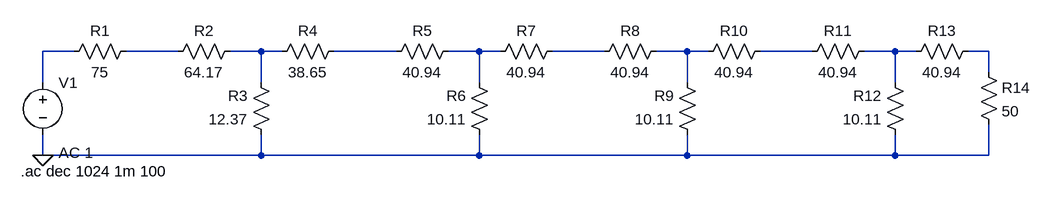
[diagram p0: schematic Draft4.asc]
Draft4.asc, the LTspice schematic file:
Version 4
SHEET 1 1476 680
WIRE 0 80 -48 80
WIRE 160 80 80 80
WIRE 288 80 240 80
WIRE 320 80 288 80
WIRE 496 80 400 80
WIRE 624 80 576 80
WIRE 656 80 624 80
WIRE 816 80 736 80
WIRE 944 80 896 80
WIRE 976 80 944 80
WIRE 1136 80 1056 80
WIRE 1264 80 1216 80
WIRE 1296 80 1264 80
WIRE 1408 80 1376 80
WIRE 1408 112 1408 80
WIRE -48 128 -48 80
WIRE 288 128 288 80
WIRE 624 128 624 80
WIRE 944 128 944 80
WIRE 1264 128 1264 80
WIRE -48 240 -48 208
WIRE 288 240 288 208
WIRE 288 240 -48 240
WIRE 624 240 624 208
WIRE 624 240 288 240
WIRE 944 240 944 208
WIRE 944 240 624 240
WIRE 1264 240 1264 208
WIRE 1264 240 944 240
WIRE 1408 240 1408 192
WIRE 1408 240 1264 240
FLAG -48 240 0
SYMBOL voltage -48 112 R0
WINDOW 123 24 124 Left 2
WINDOW 39 0 0 Left 0
SYMATTR InstName V1
SYMATTR Value ""
SYMATTR Value2 AC 1
SYMBOL res 96 64 R90
WINDOW 0 0 56 VBottom 2
WINDOW 3 32 56 VTop 2
SYMATTR InstName R1
SYMATTR Value 75
SYMBOL res 256 64 R90
WINDOW 0 0 56 VBottom 2
WINDOW 3 32 56 VTop 2
SYMATTR InstName R2
SYMATTR Value 64.17
SYMBOL res 304 224 R180
WINDOW 0 36 76 Left 2
WINDOW 3 36 40 Left 2
SYMATTR InstName R3
SYMATTR Value 12.37
SYMBOL res 304 96 R270
WINDOW 0 32 56 VTop 2
WINDOW 3 0 56 VBottom 2
SYMATTR InstName R4
SYMATTR Value 38.65
SYMBOL res 592 64 R90
WINDOW 0 0 56 VBottom 2
WINDOW 3 32 56 VTop 2
SYMATTR InstName R5
SYMATTR Value 40.94
SYMBOL res 640 224 R180
WINDOW 0 36 76 Left 2
WINDOW 3 36 40 Left 2
SYMATTR InstName R6
SYMATTR Value 10.11
SYMBOL res 640 96 R270
WINDOW 0 32 56 VTop 2
WINDOW 3 0 56 VBottom 2
SYMATTR InstName R7
SYMATTR Value 40.94
SYMBOL res 912 64 R90
WINDOW 0 0 56 VBottom 2
WINDOW 3 32 56 VTop 2
SYMATTR InstName R8
SYMATTR Value 40.94
SYMBOL res 960 224 R180
WINDOW 0 36 76 Left 2
WINDOW 3 36 40 Left 2
SYMATTR InstName R9
SYMATTR Value 10.11
SYMBOL res 960 96 R270
WINDOW 0 32 56 VTop 2
WINDOW 3 0 56 VBottom 2
SYMATTR InstName R10
SYMATTR Value 40.94
SYMBOL res 1232 64 R90
WINDOW 0 0 56 VBottom 2
WINDOW 3 32 56 VTop 2
SYMATTR InstName R11
SYMATTR Value 40.94
SYMBOL res 1280 224 R180
WINDOW 0 36 76 Left 2
WINDOW 3 36 40 Left 2
SYMATTR InstName R12
SYMATTR Value 10.11
SYMBOL res 1280 96 R270
WINDOW 0 32 56 VTop 2
WINDOW 3 0 56 VBottom 2
SYMATTR InstName R13
SYMATTR Value 40.94
SYMBOL res 1392 96 R0
SYMATTR InstName R14
SYMATTR Value 50
TEXT -82 264 Left 2 !.ac dec 1024 1m 100

The netlist it stands for:
* Draft4.asc
V1 N001 0 AC 1
R1 N002 N001 75
R2 N003 N002 64.17
R3 0 N003 12.37
R4 N003 N004 38.65
R5 N005 N004 40.94
R6 0 N005 10.11
R7 N005 N006 40.94
R8 N007 N006 40.94
R9 0 N007 10.11
R10 N007 N008 40.94
R11 N009 N008 40.94
R12 0 N009 10.11
R13 N009 N010 40.94
R14 N010 0 50
.ac dec 1024 1m 100
.backanno
.end